# EAGLE design timmer (EAGLE 5.04)
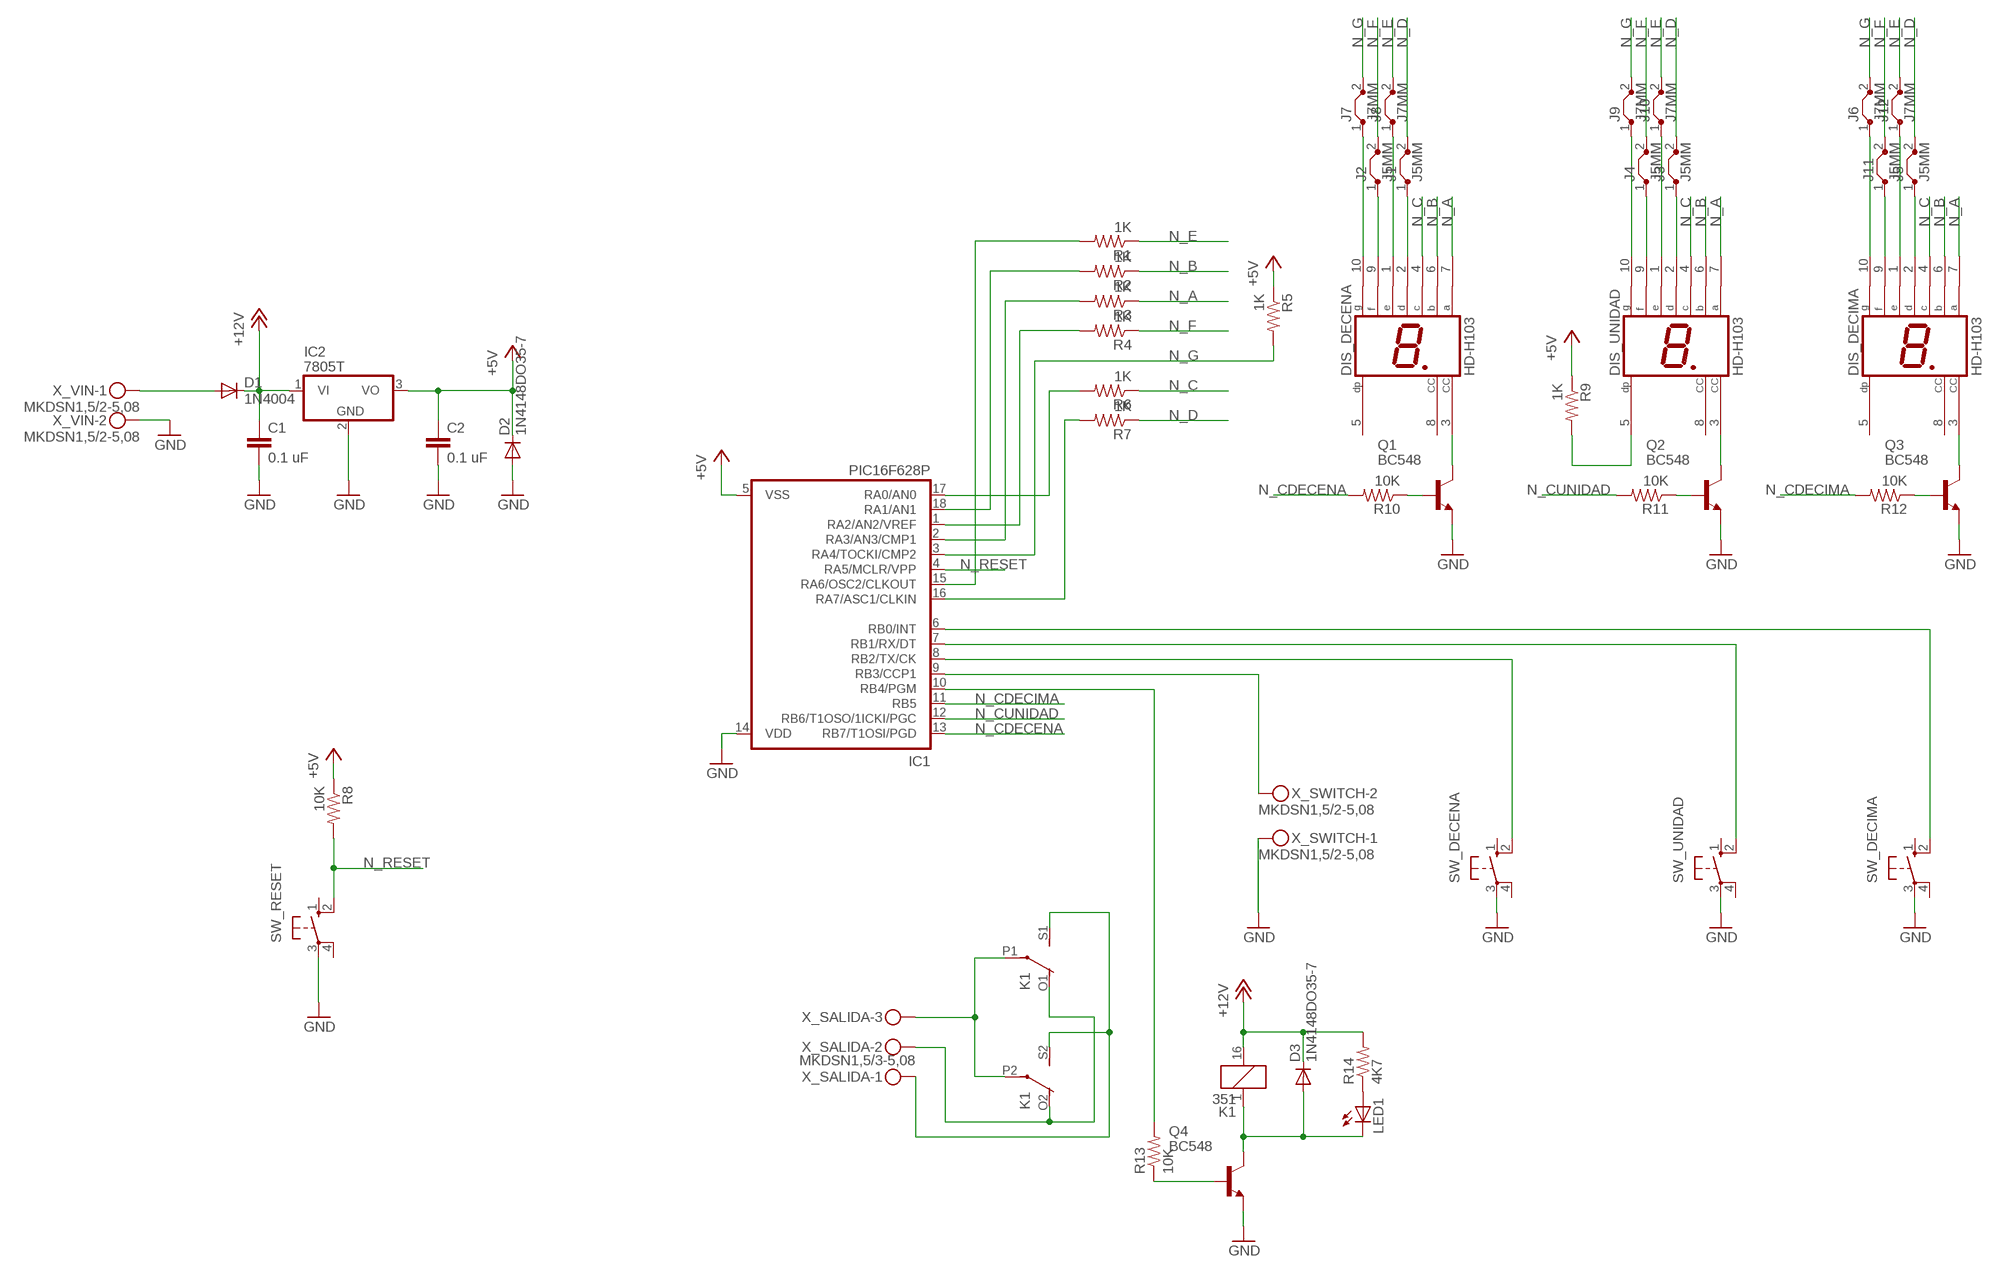
[diagram p0: schematic, sheet 1]

## Parts
C1  0.1 uF  C-EU050-025X075  [C050-025X075]
C2  0.1 uF  C-EU050-025X075  [C050-025X075]
D1  1N4004  [DO41-10]
D2  1N4148DO35-7  [DO35-7]
D3  1N4148DO35-7  [DO35-7]
DIS_DECENA  HD-H103  [HDSP-M]
DIS_DECIMA  HD-H103  [HDSP-M]
DIS_UNIDAD  HD-H103  [HDSP-M]
IC1  PIC16F628P  [DIL18]
IC2  7805T  [TO220H]
J1  J5MM  [05]
J2  J5MM  [05]
J3  J5MM  [05]
J4  J5MM  [05]
J5  J5MM  [05]
J6  J7MM  [07]
J7  J7MM  [07]
J8  J7MM  [07]
J9  J7MM  [07]
J10  J7MM  [07]
J11  J5MM  [05]
J12  J7MM  [07]
K1  351  [351]
LED1  LED5MM  [LED5MM]
Q1  BC548  [TO92-EBC]
Q2  BC548  [TO92-EBC]
Q3  BC548  [TO92-EBC]
Q4  BC548  [TO92-EBC]
R1  1K  R-US_0207/10  [0207/10]
R2  1K  R-US_0207/10  [0207/10]
R3  1K  R-US_0207/10  [0207/10]
R4  1K  R-US_0207/10  [0207/10]
R5  1K  R-US_0207/10  [0207/10]
R6  1K  R-US_0207/10  [0207/10]
R7  1K  R-US_0207/10  [0207/10]
R8  10K  R-US_0207/10  [0207/10]
R9  1K  R-US_0207/10  [0207/10]
R10  10K  R-US_0207/10  [0207/10]
R11  10K  R-US_0207/10  [0207/10]
R12  10K  R-US_0207/10  [0207/10]
R13  10K  R-US_0207/10  [0207/10]
R14  4K7  R-US_0207/10  [0207/10]
SW_DECENA  10-XX  [B3F-10XX]
SW_DECIMA  10-XX  [B3F-10XX]
SW_RESET  10-XX  [B3F-10XX]
SW_UNIDAD  10-XX  [B3F-10XX]
X_SALIDA  MKDSN1,5/3-5,08  [MKDSN1,5/3-5,08]
X_SWITCH  MKDSN1,5/2-5,08  [MKDSN1,5/2-5,08]
X_VIN  MKDSN1,5/2-5,08  [MKDSN1,5/2-5,08]

## Nets
+5V: C2.1 D2.C IC1.5(VSS) IC2.3(VO) R5.1 R8.1 R9.1
+12V: C1.1 D1.C D3.C IC2.1(VI) K1.16 R14.2
GND: C1.2 C2.2 D2.A IC1.14(VDD) IC2.2(GND) Q1.E Q2.E Q3.E Q4.E SW_DECENA.3(P) SW_DECIMA.3(P) SW_RESET.3(P) SW_UNIDAD.3(P) X_SWITCH.1 X_VIN.2
N$1: DIS_UNIDAD.5(DP) R9.2
N$2: IC1.16(RA7/ASC1/CLKIN) R7.2
N$3: IC1.17(RA0/AN0) R6.2
N$4: DIS_DECENA.3(CC) Q1.C
N$5: DIS_DECIMA.10(G) J6.1
N$6: IC1.2(RA3/AN3/CMP1) R3.2
N$7: IC1.18(RA1/AN1) R2.2
N$8: IC1.15(RA6/OSC2/CLKOUT) R1.2
N$9: DIS_UNIDAD.3(CC) Q2.C
N$10: DIS_DECIMA.3(CC) Q3.C
N$11: Q1.B R10.1
N$12: Q2.B R11.1
N$13: Q3.B R12.1
N$14: IC1.10(RB4/PGM) R13.2
N$15: IC1.9(RB3/CCP1) X_SWITCH.2
N$16: IC1.8(RB2/TX/CK) SW_DECENA.2(S1)
N$17: IC1.7(RB1/RX/DT) SW_UNIDAD.2(S1)
N$18: IC1.6(RB0/INT) SW_DECIMA.2(S1)
N$19: D3.A K1.1 LED1.K(C) Q4.C
N$20: DIS_DECENA.10(G) J7.1
N$21: DIS_DECENA.9(F) J2.1
N$22: DIS_DECENA.1(E) J8.1
N$23: DIS_DECENA.2(D) J1.1
N$24: DIS_UNIDAD.10(G) J9.1
N$25: DIS_UNIDAD.9(F) J4.1
N$26: DIS_UNIDAD.1(E) J10.1
N$27: DIS_UNIDAD.2(D) J3.1
N$28: DIS_DECIMA.9(F) J11.1
N$30: DIS_DECIMA.1(E) J12.1
N$31: DIS_DECIMA.2(D) J5.1
N$32: D1.A X_VIN.1
N$33: Q4.B R13.1
N$34: K1.P1(2:P) K1.P2(3:P) X_SALIDA.3
N$35: LED1.A R14.1
N$36: K1.O1(2:O) K1.O2(3:O) X_SALIDA.2
N$37: IC1.1(RA2/AN2/VREF) R4.2
N$38: K1.S1(2:S) K1.S2(3:S) X_SALIDA.1
N_A: DIS_DECENA.7(A) DIS_DECIMA.7(A) DIS_UNIDAD.7(A) R3.1
N_B: DIS_DECENA.6(B) DIS_DECIMA.6(B) DIS_UNIDAD.6(B) R2.1
N_C: DIS_DECENA.4(C) DIS_DECIMA.4(C) DIS_UNIDAD.4(C) R6.1
N_CDECENA: IC1.13(RB7/T1OSI/PGD) R10.2
N_CDECIMA: IC1.11(RB5) R12.2
N_CUNIDAD: IC1.12(RB6/T1OSO/1ICKI/PGC) R11.2
N_D: J1.2 J3.2 J5.2 R7.1
N_E: J8.2 J10.2 J12.2 R1.1
N_F: J2.2 J4.2 J11.2 R4.1
N_G: IC1.3(RA4/TOCKI/CMP2) J6.2 J7.2 J9.2 R5.2
N_RESET: IC1.4(RA5/MCLR/VPP) R8.2 SW_RESET.2(S1)
Unconnected: DIS_DECENA.5(DP) DIS_DECENA.8(CC) DIS_DECIMA.5(DP) DIS_DECIMA.8(CC) DIS_UNIDAD.8(CC) SW_DECENA.1(S) SW_DECENA.4(P1) SW_DECIMA.1(S) SW_DECIMA.4(P1) SW_RESET.1(S) SW_RESET.4(P1) SW_UNIDAD.1(S) SW_UNIDAD.4(P1)

## Library data of the parts
C1 C2 = rcl:C-EU: CAPACITOR, European symbol
D1 = diode:1N4004: DIODE general purpose rectifier, 1 A
D2 D3 = diode:1N4148: DIODE high speed (Philips)
DIS_DECENA DIS_DECIMA DIS_UNIDAD = display-hp:HD-H103: LED DISPLAY 1-character 7 segment, decimal point right
IC1 = microchip:PIC16*F62: FLASH-Based 8-Bit CMOS Microcontroller Source: http://ww1.microchip.com/downloads/en/DeviceDoc/40300C.pdf
IC2 = linear:78*: Positive VOLTAGE REGULATOR Source: http://cache.national.com/ds/LM/LM78L05.pdf http://www.fairchildsemi.com/ds/LM/LM7805.pdf
J1-J12 = jumper:J: Bridge
K1 = relay:351: RELAY 2 x switch, Omron
LED1 = led:LED: LED OSRAM: - CHIPLED LG R971, LG N971, LY N971, LG Q971, LY Q971, LO R971, LY R971 LH N974, LH R974 LS Q976, LO Q976, LY Q976 LO Q996 - Hyper CHIPLED LW Q18S LB Q993, LB Q99A, LB R99A - SideLED LS A670, LO A670, LY A670, LG A670, LP A670 LB A673, LV A673, LT A673, LW A673 LH A674 LY A675 LS A676, LA A676, LO A676, LY A676, LW A676 LS A679, LY A679, LG A679 - Hyper Micro SIDELED® LS Y876, LA Y876, LO Y876, LY Y876 LT Y87S - SmartLED LW L88C, LW L88S LB L89C, LB L89S, LG L890 LS L89K, LO L89K, LY L89K LS L896, LA L896, LO L896, LY L896 - TOPLED LS T670, LO T670, LY T670, LG T670, LP T670 LSG T670, LSP T670, LSY T670, LOP T670, LYG T670 LG T671, LOG T671, LSG T671 LB T673, LV T673, LT T673, LW T673 LH T674 LS T676, LA T676, LO T676, LY T676, LB T676, LH T676, LSB T676, LW T676 LB T67C, LV T67C, LT T67C, LS T67K, LO T67K, LY T67K, LW E67C LS E67B, LA E67B, LO E67B, LY E67B, LB E67C, LV E67C, LT E67C LW T67C LS T679, LY T679, LG T679 LS T770, LO T770, LY T770, LG T770, LP T770 LB T773, LV T773, LT T773, LW T773 LH T774 LS E675, LA E675, LY E675, LS T675 LS T776, LA T776, LO T776, LY T776, LB T776 LHGB T686 LT T68C, LB T68C - Hyper Mini TOPLED® LB M676 - Mini TOPLED Santana® LG M470 LS M47K, LO M47K, LY M47K Source: http://www.osram.convergy.de LUXEON: - LUMILED® LXK2-PW12-R00, LXK2-PW12-S00, LXK2-PW14-U00, LXK2-PW14-V00 LXK2-PM12-R00, LXK2-PM12-S00, LXK2-PM14-U00 LXK2-PE12-Q00, LXK2-PE12-R00, LXK2-PE12-S00, LXK2-PE14-T00, LXK2-PE14-U00 LXK2-PB12-K00, LXK2-PB12-L00, LXK2-PB12-M00, LXK2-PB14-N00, LXK2-PB14-P00, LXK2-PB14-Q00 LXK2-PR12-L00, LXK2-PR12-M00, LXK2-PR14-Q00, LXK2-PR14-R00 LXK2-PD12-Q00, LXK2-PD12-R00, LXK2-PD12-S00 LXK2-PH12-R00, LXK2-PH12-S00 LXK2-PL12-P00, LXK2-PL12-Q00, LXK2-PL12-R00 Source: www.luxeon.com KINGBRIGHT: KA-3528ASYC Source: www.kingbright.com
Q1-Q4 = transistor-npn:BC548*: NPN Transistor
R1-R14 = rcl:R-US_: RESISTOR, American symbol
SW_DECENA SW_DECIMA SW_RESET SW_UNIDAD = switch-omron:10-XX: OMRON SWITCH
X_SALIDA = con-phoenix-508:MKDSN1,5/3-5,08: MKDSN 1,5/ 3-5,08 Printklemme Nennstrom: 13,5 A Nennspannung: 250 V Rastermaß: 5,08 mm Polzahl: 3 Anschlussart: Schraubanschluss Montage: Löten Anschlussrichtung Leiter/Platine: 0 ° Artikelnummer: 1729131 Source: http://eshop.phoenixcontact.com .. 1729131.pdf
X_SWITCH X_VIN = con-phoenix-508:MKDSN1,5/2-5,08: MKDSN 1,5/ 2-5,08 Printklemme Nennstrom: 13,5 A Nennspannung: 250 V Rastermaß: 5,08 mm Polzahl: 2 Anschlussart: Schraubanschluss Montage: Löten Anschlussrichtung Leiter/Platine: 0 ° Artikelnummer: 1729128 Source: http://eshop.phoenixcontact.com .. 1729128.pdf

## Board
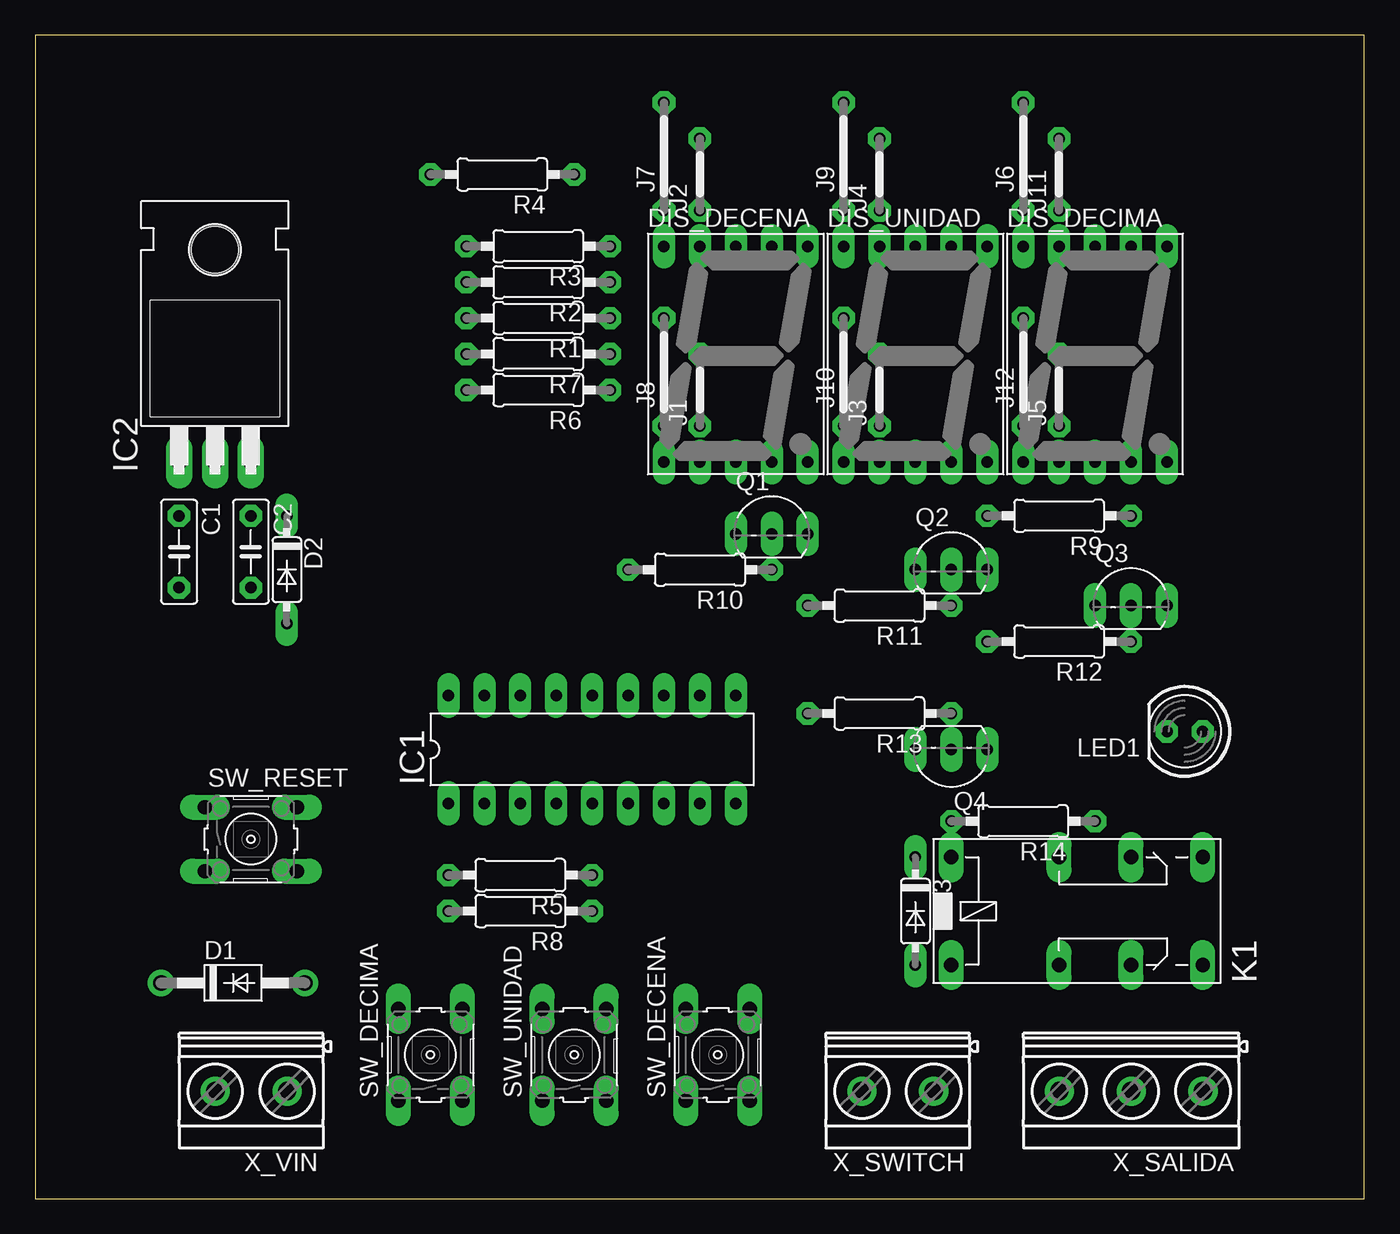
[diagram p1: board, top side]
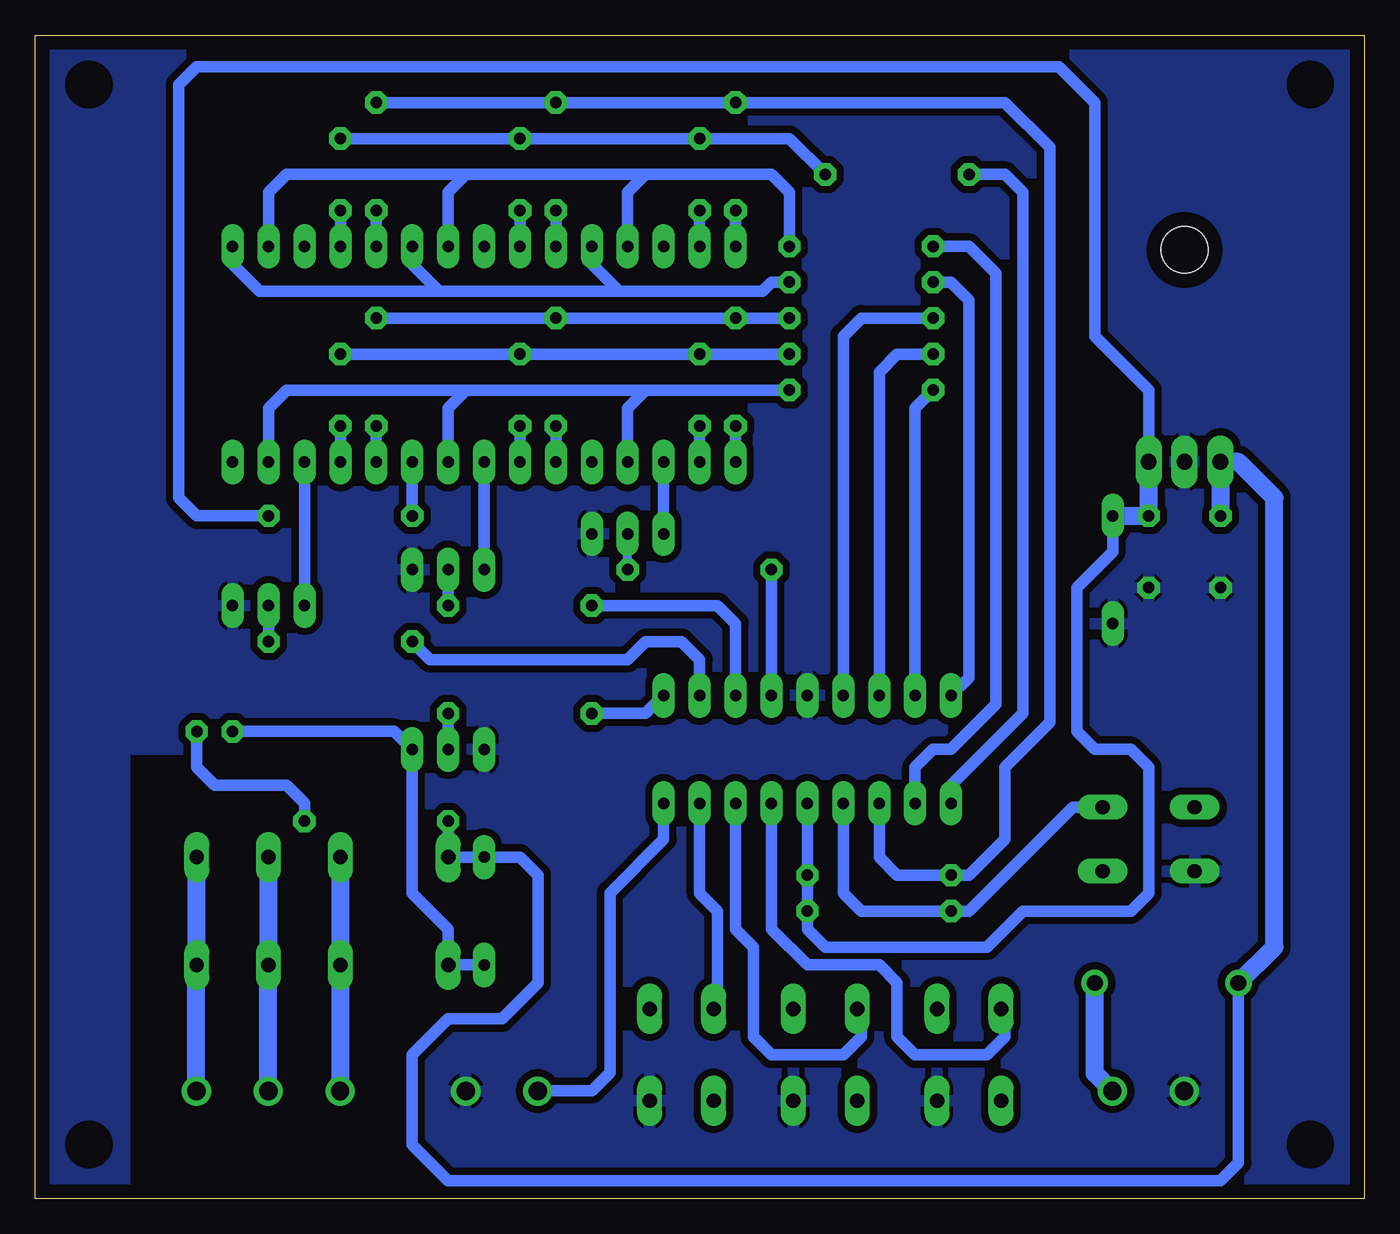
[diagram p2: board, bottom side, seen from below]

Size 93.96 x 82.22 mm. Coordinates in mm from the lower left corner, seen from the top.
Outline: 0,0 93.96,0 93.96,82.22 0,82.22 0,0
Copper layers (1*16): Top 0.035mm / dielectric 1.5mm / Bottom 0.035mm
Design rules "default *": minimum track width 25mil, minimum drill 24mil, track to track 20mil, track to pad 15mil, pad to pad 15mil, via to via 8mil, smd to smd 8mil, copper to edge 40mil, drill to drill 15mil, minimum pad ring 15mil, minimum via ring 8mil, stop-mask expansion 4mil, vias tented up to drill 0mil, thermal gap 10mil
bRestrict: area 2.5,77.5 to 5.1,80; area 2.5,2.5 to 5.1,5.1; area 88.9,2.5 to 91.4,5.1; area 88.9,77.5 to 91.4,80
vRestrict: area 2.5,2.5 to 5.1,5.1; area 88.9,2.5 to 91.4,5.1; area 88.9,77.5 to 91.4,80; area 2.5,77.5 to 5.1,80

### Footprints (pad centres in the part's own frame; a part is rotated, then mirrored left to right if it is on the bottom)
C050-025X075 = drill 0.813 octagon: 1 -2.54,0; 2 2.54,0
DO41-10 = drill 1.118 round: A 5.08,0; C -5.08,0
DO35-7 = drill 0.813 long: A 3.81,0; C -3.81,0
HDSP-M = drill 0.813 long: 1 -5.08,-7.62; 2 -2.54,-7.62; 3 0,-7.62; 4 2.54,-7.62; 5 5.08,-7.62; 6 5.08,7.62; 7 2.54,7.62; 8 0,7.62; 9 -2.54,7.62; 10 -5.08,7.62
DIL18 = drill 0.813 long: 1 -10.16,-3.81; 2 -7.62,-3.81; 3 -5.08,-3.81; 4 -2.54,-3.81; 5 0,-3.81; 6 2.54,-3.81; 7 5.08,-3.81; 8 7.62,-3.81; 9 10.16,-3.81; 10 10.16,3.81; 11 7.62,3.81; 12 5.08,3.81; 13 2.54,3.81; 14 0,3.81; 15 -2.54,3.81; 16 -5.08,3.81; 17 -7.62,3.81; 18 -10.16,3.81
TO220H = drill 1.118 long: 1 -2.54,-10.16; 2 0,-10.16; 3 2.54,-10.16 | hole 3.302: 0,4.826
05 = drill 0.813 pad 1.6 octagon: 1 -2.54,0; 2 2.54,0
07 = drill 0.813 pad 1.6 octagon: 1 -3.81,0; 2 3.81,0
351 = drill 1.016 long: 1 -3.81,-3.81; 16 -3.81,3.81; O1 8.89,-3.81; O2 8.89,3.81; P1 3.81,-3.81; P2 3.81,3.81; S1 13.97,-3.81; S2 13.97,3.81
LED5MM = drill 0.813 octagon: A -1.27,0; K 1.27,0
TO92-EBC = drill 0.813 long: B 0,-1.27; C -2.54,-1.27; E 2.54,-1.27
0207/10 = drill 0.813 octagon: 1 -5.08,0; 2 5.08,0
B3F-10XX = drill 1.016 long: 1 -3.251,2.261; 2 3.251,2.261; 3 -3.251,-2.261; 4 3.251,-2.261
MKDSN1,5/3-5,08 = drill 1.3 pad 2 round: 1 -7.641,0.025; 2 -2.561,0.025; 3 2.519,0.025
MKDSN1,5/2-5,08 = drill 1.3 pad 2 round: 1 -2.561,0.025; 2 2.519,0.025

### Placement (x,y rotation side)
C1  10.16,45.72 270 top
C2  15.24,45.72 270 top
D1  13.97,15.24 0 top
D2  17.78,44.45 270 top
D3  62.23,20.32 270 top
DIS_DECENA  49.53,59.69 0 top
DIS_DECIMA  74.93,59.69 0 top
DIS_UNIDAD  62.23,59.69 0 top
IC1  39.37,31.75 0 top
IC2  12.7,62.23 0 top
J1  46.99,57.15 90 top
J2  46.99,72.39 90 top
J3  59.69,57.15 90 top
J4  59.69,72.39 90 top
J5  72.39,57.15 90 top
J6  69.85,73.66 90 top
J7  44.45,73.66 90 top
J8  44.45,58.42 90 top
J9  57.15,73.66 90 top
J10  57.15,58.42 90 top
J11  72.39,72.39 90 top
J12  69.85,58.42 90 top
K1  68.58,20.32 0 top
LED1  81.28,33.02 180 top
Q1  52.07,48.26 0 top
Q2  64.77,45.72 0 top
Q3  77.47,43.18 0 top
Q4  64.77,30.48 180 top
R1  35.56,62.23 180 top
R2  35.56,64.77 180 top
R3  35.56,67.31 180 top
R4  33.02,72.39 180 top
R5  34.29,22.86 180 top
R6  35.56,57.15 180 top
R7  35.56,59.69 180 top
R8  34.29,20.32 180 top
R9  72.39,48.26 180 top
R10  46.99,44.45 180 top
R11  59.69,41.91 180 top
R12  72.39,39.37 180 top
R13  59.69,34.29 180 top
R14  69.85,26.67 180 top
SW_DECENA  48.26,10.16 90 top
SW_DECIMA  27.94,10.16 90 top
SW_RESET  15.24,25.4 0 top
SW_UNIDAD  38.1,10.16 90 top
X_SALIDA  74.93,7.62 180 top
X_SWITCH  60.96,7.62 180 top
X_VIN  15.24,7.62 180 top

### Tracks (layer width: path | path; a pad name or v marks a point on that pad's centre or on a via)
+5V
  Bottom 0.813: D2.C 17.78,45.72 20.32,43.18 20.32,33.02 19.05,31.75 16.51,31.75 15.24,30.48 15.24,21.59 16.51,20.32 24.13,20.32 26.67,17.78 38.1,17.78 39.37,19.05 R8.1 R5.1 IC1.5 | R9.1 82.55,48.26 83.82,49.53 83.82,78.74 82.55,80.01 21.59,80.01 19.05,77.47 19.05,60.96 15.24,57.15 IC2.3
  Bottom 1.27: IC2.3 C2.1 D2.C
+12V
  Bottom 0.813: R14.2 K1.16 D3.C 59.69,24.13 58.42,22.86 58.42,15.24 60.96,12.7 64.77,12.7 67.31,10.16 67.31,3.81 64.77,1.27 10.16,1.27 8.89,2.54 D1.C
  Bottom 1.27: C1.1 IC2.1 8.89,52.07 6.35,49.53 6.35,17.78 D1.C
GND
  pour Bottom: 0,82.55 93.98,82.55 93.98,0 87.63,0 87.63,31.75 66.04,31.75 66.04,0 0,0
N$1
  Bottom 0.813: R9.2 DIS_UNIDAD.5
N$2
  Bottom 0.813: IC1.16 34.29,58.42 33.02,59.69 R7.2
N$3
  Bottom 0.813: IC1.17 31.75,55.88 R6.2
N$4
  Bottom 0.813: Q1.C DIS_DECENA.3
N$5
  Bottom 0.813: DIS_DECIMA.10 J6.1
N$6
  Bottom 0.813: R3.2 27.94,67.31 26.04,65.41 26.04,34.92 29.21,31.75 30.48,31.75 31.75,30.48 IC1.2
N$7
  Bottom 0.813: R2.2 29.21,64.77 27.94,63.5 27.94,36.83 IC1.18
N$8
  Bottom 0.813: IC1.15 36.83,60.96 35.56,62.23 R1.2
N$9
  Bottom 0.813: Q2.C DIS_UNIDAD.3
N$10
  Bottom 0.813: Q3.C DIS_DECIMA.3
N$11
  Bottom 0.635: R10.1 Q1.B
N$12
  Bottom 0.813: R11.1 Q2.B
N$13
  Bottom 0.813: R12.1 Q3.B
N$14
  Bottom 0.813: R13.2 50.8,34.29 IC1.10
N$15
  Bottom 0.813: IC1.9 49.53,25.4 53.34,21.59 53.34,8.89 54.61,7.62 58.42,7.62 X_SWITCH.2
N$16
  Bottom 0.813: IC1.8 46.99,21.59 45.72,20.32 45.72,13.69 SW_DECENA.2
N$17
  Bottom 0.813: 35.84,14.25 SW_UNIDAD.2 35.56,13.13 35.56,11.43 36.83,10.16 41.91,10.16 43.18,11.43 43.18,17.78 44.45,19.05 IC1.7
N$18
  Bottom 0.813: 25.4,13.69 SW_DECIMA.2 25.4,13.13 25.4,11.43 26.67,10.16 31.75,10.16 33.02,11.43 33.02,15.24 34.29,16.51 39.37,16.51 41.91,19.05 IC1.6
N$19
  Bottom 0.813: D3.A K1.1 64.77,19.05 67.31,21.59 Q4.C 68.58,33.02 LED1.K
N$20
  Bottom 0.813: DIS_DECENA.10 J7.1
N$21
  Bottom 0.813: DIS_DECENA.9 J2.1
N$22
  Bottom 0.813: DIS_DECENA.1 J8.1
N$23
  Bottom 0.813: DIS_DECENA.2 J1.1
N$24
  Bottom 0.813: DIS_UNIDAD.10 J9.1
N$25
  Bottom 0.813: DIS_UNIDAD.9 J4.1
N$26
  Bottom 0.813: DIS_UNIDAD.1 J10.1
N$27
  Bottom 0.813: DIS_UNIDAD.2 J3.1
N$28
  Bottom 0.813: DIS_DECIMA.9 J11.1
N$30
  Bottom 0.813: DIS_DECIMA.1 J12.1
N$31
  Bottom 0.813: DIS_DECIMA.2 J5.1
N$32
  Bottom 1.27: X_VIN.1 19.05,8.84 D1.A
N$33
  Bottom 0.813: Q4.B R13.1
N$34
  Bottom 1.27: K1.P2 K1.P1 72.39,7.62 X_SALIDA.3
N$35
  Bottom 0.813: LED1.A 82.55,30.48 81.28,29.21 76.2,29.21 74.93,27.94 R14.1
N$36
  Bottom 1.27: K1.O2 K1.O1 77.49,16.49 X_SALIDA.2
N$37
  Bottom 0.813: IC1.1 29.21,29.21 24.13,34.29 24.13,71.12 25.4,72.39 R4.2
N$38
  Bottom 1.27: K1.S2 K1.S1 82.57,16.49 X_SALIDA.1
N_A
  Bottom 0.813: R3.1 40.64,71.12 41.91,72.39 50.8,72.39 | 50.8,72.39 63.5,72.39 | 63.5,72.39 76.2,72.39 77.47,71.12 DIS_DECIMA.7 | DIS_UNIDAD.7 64.77,71.12 63.5,72.39 | DIS_DECENA.7 52.07,71.12 50.8,72.39
N_B
  Bottom 0.813: DIS_DECENA.6 54.61,66.04 52.7,64.14 | DIS_DECIMA.6 80.01,66.04 78.11,64.14 65.41,64.14 | 67.31,66.04 DIS_UNIDAD.6 | 67.31,66.04 66.04,64.77 | R2.1 41.91,64.77 42.55,64.14 52.7,64.14 | 52.7,64.14 65.41,64.14 | 65.41,64.14 67.31,66.04
N_C
  Bottom 0.813: R6.1 50.8,57.15 | 50.8,57.15 63.5,57.15 | 63.5,57.15 76.2,57.15 77.47,55.88 DIS_DECIMA.4 | DIS_DECENA.4 52.07,55.88 50.8,57.15 | DIS_UNIDAD.4 64.77,55.88 63.5,57.15
N_CDECENA
  Bottom 0.813: IC1.13 R10.2
N_CDECIMA
  Bottom 0.813: IC1.11 46.99,38.1 48.26,39.37 50.8,39.37 52.07,38.1 66.04,38.1 R12.2
N_CUNIDAD
  Bottom 0.813: R11.2 45.72,41.91 44.45,40.64 IC1.12
N_D
  Bottom 0.813: R7.1 J1.2 J3.2 J5.2
N_E
  Bottom 0.813: J12.2 J10.2 J8.2 R1.1
N_F
  Bottom 0.813: J11.2 J4.2 J2.2 40.64,74.93 R4.1
N_G
  Bottom 0.813: J6.2 J9.2 J7.2 25.4,77.47 22.23,74.3 22.23,33.66 25.4,30.48 25.4,25.4 27.94,22.86 R5.2 33.02,22.86 34.29,24.13 IC1.3
N_RESET
  Bottom 0.813: IC1.4 36.83,21.59 35.56,20.32 R8.2 27.94,20.32 20.6,27.66 SW_RESET.2